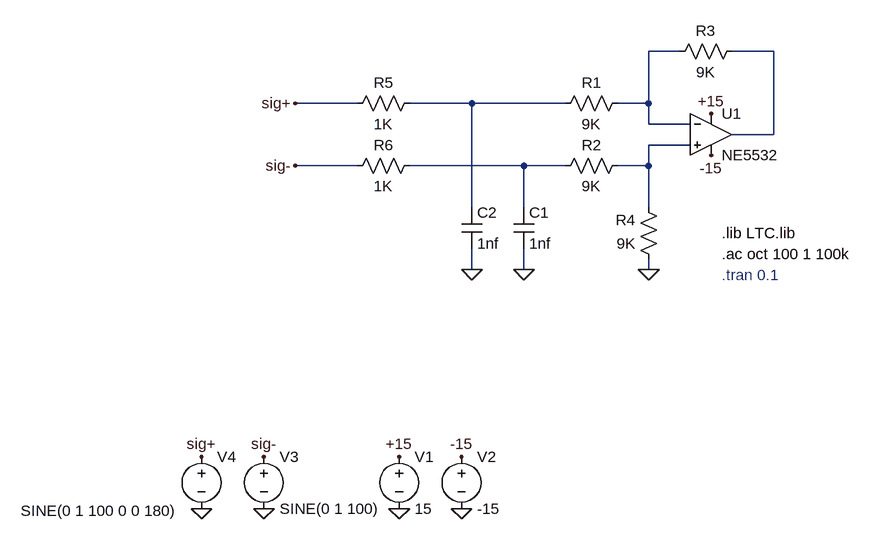
[diagram p0: schematic Balanced Input.asc]
Balanced Input.asc, the LTspice schematic file:
Version 4
SHEET 1 932 864
WIRE 656 144 608 144
WIRE 800 144 736 144
WIRE 160 224 64 224
WIRE 336 224 240 224
WIRE 480 224 336 224
WIRE 608 224 608 144
WIRE 608 224 560 224
WIRE 608 256 608 224
WIRE 672 256 608 256
WIRE 800 272 800 144
WIRE 800 272 736 272
WIRE 672 288 608 288
WIRE 160 320 64 320
WIRE 416 320 240 320
WIRE 480 320 416 320
WIRE 608 320 608 288
WIRE 608 320 560 320
WIRE 336 384 336 224
WIRE 416 384 416 320
WIRE 608 384 608 320
WIRE 336 480 336 448
WIRE 416 480 416 448
WIRE 608 480 608 464
FLAG 704 240 +15
FLAG 704 304 -15
FLAG 224 768 +15
FLAG 320 768 -15
FLAG 224 848 0
FLAG 320 848 0
FLAG 336 480 0
FLAG 416 480 0
FLAG 608 480 0
FLAG 16 768 sig-
FLAG 16 848 0
FLAG -80 768 sig+
FLAG -80 848 0
FLAG 64 224 sig+
FLAG 64 320 sig-
SYMBOL OpAmps/opamp2 704 208 R0
SYMATTR InstName U1
SYMATTR Value NE5532
SYMBOL voltage 224 752 R0
SYMATTR InstName V1
SYMATTR Value 15
SYMBOL voltage 320 752 R0
SYMATTR InstName V2
SYMATTR Value -15
SYMBOL res 576 208 R90
WINDOW 0 0 56 VBottom 2
WINDOW 3 32 56 VTop 2
SYMATTR InstName R1
SYMATTR Value 9K
SYMBOL res 576 304 R90
WINDOW 0 0 56 VBottom 2
WINDOW 3 32 56 VTop 2
SYMATTR InstName R2
SYMATTR Value 9K
SYMBOL res 752 128 R90
WINDOW 0 0 56 VBottom 2
WINDOW 3 32 56 VTop 2
SYMATTR InstName R3
SYMATTR Value 9K
SYMBOL res 624 480 R180
WINDOW 0 36 76 Left 2
WINDOW 3 36 40 Left 2
SYMATTR InstName R4
SYMATTR Value 9K
SYMBOL cap 400 384 R0
SYMATTR InstName C1
SYMATTR Value 1nf
SYMBOL cap 320 384 R0
SYMATTR InstName C2
SYMATTR Value 1nf
SYMBOL res 256 208 R90
WINDOW 0 0 56 VBottom 2
WINDOW 3 32 56 VTop 2
SYMATTR InstName R5
SYMATTR Value 1K
SYMBOL res 256 304 R90
WINDOW 0 0 56 VBottom 2
WINDOW 3 32 56 VTop 2
SYMATTR InstName R6
SYMATTR Value 1K
SYMBOL voltage 16 752 R0
SYMATTR InstName V3
SYMATTR Value SINE(0 1 100)
SYMATTR Value2 AC 1
SYMBOL voltage -80 752 R0
WINDOW 3 -278 99 Left 2
SYMATTR InstName V4
SYMATTR Value SINE(0 1 100 0 0 180)
SYMATTR Value2 AC 1 180
TEXT 720 424 Left 2 !.lib LTC.lib
TEXT 720 456 Left 2 !.ac oct 100 1 100k
TEXT 720 488 Left 2 ;.tran 0.1

The netlist it stands for:
* Balanced Input.asc
XU1 N004 N001 +15 -15 N002 NE5532  ; pins In+ In- V+ V- OUT
V1 +15 0 15
V2 -15 0 -15
R1 N001 N003 9K
R2 N004 N005 9K
R3 N002 N001 9K
R4 0 N004 9K
C1 N005 0 1nf
C2 N003 0 1nf
R5 N003 sig+ 1K
R6 N005 sig- 1K
V3 sig- 0 SINE(0 1 100) AC 1
V4 sig+ 0 SINE(0 1 100 0 0 180) AC 1 180
.lib LTC.lib
.ac oct 100 1 100k
* .tran 0.1
.backanno
.end